# Altium schematic sheet Schematic.schdoc
size A
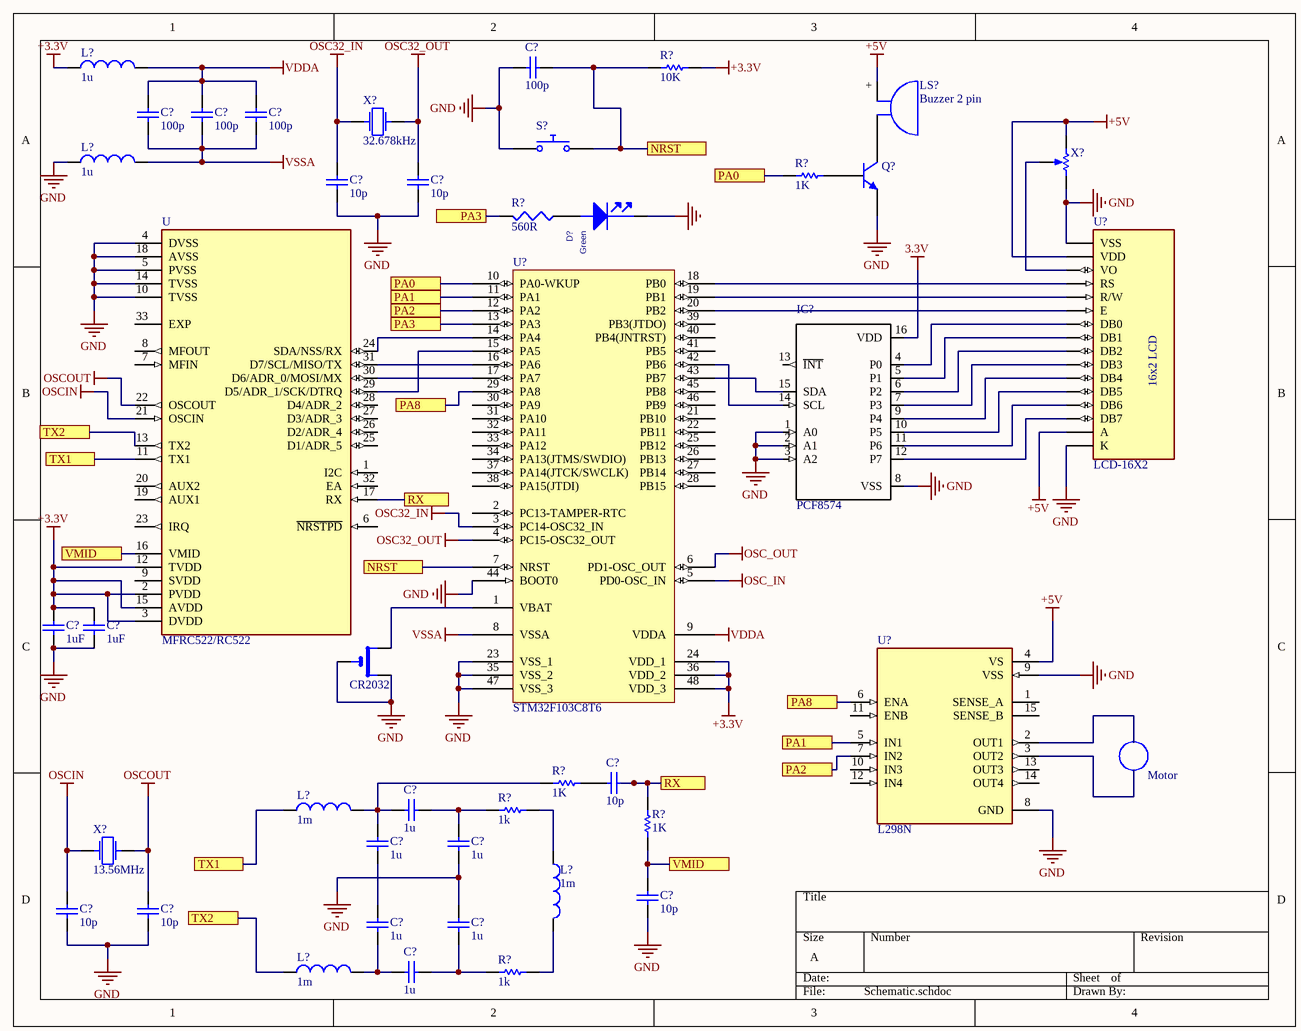
[diagram p0: Schematic.schdoc]

## Parts
(Parts that share a designator on the sheet are numbered #1, #2 ... from top to bottom, then left to right.)
?  CR2032  [CR2032-SMD]
C?#1  value 100p  (hidden comment: Capacitor)
C?#2  value 100p  (hidden comment: Capacitor)
C?#3  value 100p  (hidden comment: Capacitor)
C?#4  value 100p  (hidden comment: Capacitor)
C?#5  value 10p  (hidden comment: Capacitor)
C?#6  value 10p  (hidden comment: Capacitor)
C?#7  value 1uF  (hidden comment: Capacitor)
C?#8  value 1uF  (hidden comment: Capacitor)
C?#9  value 10p  (hidden comment: Capacitor)
C?#10  value 1u  (hidden comment: Capacitor)
C?#11  value 1u  (hidden comment: Capacitor)
C?#12  value 1u  (hidden comment: Capacitor)
C?#13  value 10p  (hidden comment: Capacitor)
C?#14  value 10p  (hidden comment: Capacitor)
C?#15  value 10p  (hidden comment: Capacitor)
C?#16  value 1u  (hidden comment: Capacitor)
C?#17  value 1u  (hidden comment: Capacitor)
C?#18  value 1u  (hidden comment: Capacitor)
D?  Green  [LED_0603]
IC?  PCF8574  [*DIL16]
L?#1  value 1u  (hidden comment: Inductor)
L?#2  value 1u  (hidden comment: Inductor)
L?#3  value 1m  (hidden comment: Inductor)
L?#4  value 1m  (hidden comment: Inductor)
L?#5  value 1m  (hidden comment: Inductor)
LS?  Buzzer 2 pin
Q?  Bipolar NPN 3 Pins Transistor VBIC Model  (value not drawn)
R?#1  value 10K  (hidden comment: Resistor)
R?#2  value 1K  (hidden comment: Resistor)
R?#3  560R  [R0805]
R?#4  value 1K  (hidden comment: Resistor)
R?#5  value 1k  (hidden comment: Resistor)
R?#6  value 1K  (hidden comment: Resistor)
R?#7  value 1k  (hidden comment: Resistor)
S?  Push Button Normally Opened  (value not drawn)
U  MFRC522/RC522  [QFN50P500X500X100-33N]
U?#1  LCD-16X2  [MODULE_LCD-16X2]
U?#2  STM32F103C8T6  [SQFP50P900X900-48L]
U?#3  L298N  [TO127P2020X500X2100-15]
X?#1  F0: 32.678kHz  (hidden comment: Crystal)
X?#2  Potentiometer  (value not drawn)
X?#3  F0: 13.56MHz  (hidden comment: Crystal)

## Ports
NRST, PA0, PA1, PA2, PA3, PA8, RX, TX1, TX2, VMID

## Nets
3.3V: IC?.16(VDD)
+3.3V: C?#7.1 C?#8.1 L?#1.1 R?#1.2 U.2(PVDD) U.3(DVDD) U.12(TVDD) U.15(AVDD) U?#2.24(VDD_1) U?#2.36(VDD_2) U?#2.48(VDD_3)
+5V: LS?.+ U?#1.2(VDD) U?#1.15(A) U?#3.4(VS) X?#2.1(TOP)
GND: ?.+$2(+1) ?.NEG C?#1.2 C?#5.2 C?#6.2 C?#7.2 C?#8.2 C?#12.1 C?#13.2 C?#14.2 C?#15.1 C?#17.2 D?.1(cathode) IC?.1(A0) IC?.2(A1) IC?.3(A2) IC?.8(VSS) L?#2.1 Q?.3(E) S?.1 U.4(DVSS) U.5(PVSS) U.10(TVSS) U.14(TVSS) U.18(AVSS) U?#1.1(VSS) U?#1.16(K) U?#2.23(VSS_1) U?#2.35(VSS_2) U?#2.44(BOOT0) U?#2.47(VSS_3) U?#3.8(GND) U?#3.9(VSS) X?#2.2(BOT)
OSC32_IN: C?#5.1 U?#2.3(PC14-OSC32_IN) X?#1.2
OSC32_OUT: C?#6.1 U?#2.4(PC15-OSC32_OUT) X?#1.1
OSC_IN: U?#2.5(PD0-OSC_IN)
OSC_OUT: U?#2.6(PD1-OSC_OUT)
OSCIN: C?#13.1 U.21(OSCIN) X?#3.2
OSCOUT: C?#14.1 U.22(OSCOUT) X?#3.1
VDDA: C?#2.1 C?#3.1 C?#4.2 L?#1.2 U?#2.9(VDDA)
VSSA: C?#2.2 C?#3.2 C?#4.1 L?#2.2 U?#2.8(VSSA)
NRST: C?#1.1 R?#1.1 S?.2 U?#2.7(NRST) ; port NRST
PA0: R?#2.1 U?#2.10(PA0-WKUP) ; port PA0
PA1: U?#2.11(PA1) U?#3.5(IN1) ; port PA1
PA2: U?#2.12(PA2) U?#3.7(IN2) ; port PA2
PA3: R?#3.2 U?#2.13(PA3) ; port PA3
PA8: U?#2.29(PA8) U?#3.6(ENA) ; port PA8
RX: C?#9.2 R?#6.2 U.17(RX) ; port RX
TX1: L?#3.1 U.11(TX1) ; port TX1
TX2: L?#5.1 U.13(TX2) ; port TX2
VMID: C?#15.2 R?#6.1 U.16(VMID) ; port VMID
Net?_+$1: ?.+$1(POS) U?#2.1(VBAT)
NetC?#9_1: C?#9.1 R?#4.2
NetC?#10_1: C?#10.1 C?#11.2 L?#3.2 R?#4.1
NetC?#10_2: C?#10.2 C?#12.2 R?#5.1
NetC?#11_1: C?#11.1 C?#16.2
NetC?#16_1: C?#16.1 C?#18.1 L?#5.2
NetC?#17_1: C?#17.1 C?#18.2 R?#7.1
NetD?_2: D?.2(ANODE) R?#3.1
NetIC?_4: IC?.4(P0) U?#1.7(DB0)
NetIC?_5: IC?.5(P1) U?#1.8(DB1)
NetIC?_6: IC?.6(P2) U?#1.9(DB2)
NetIC?_7: IC?.7(P3) U?#1.10(DB3)
NetIC?_9: IC?.9(P4) U?#1.11(DB4)
NetIC?_10: IC?.10(P5) U?#1.12(DB5)
NetIC?_11: IC?.11(P6) U?#1.13(DB6)
NetIC?_12: IC?.12(P7) U?#1.14(DB7)
NetIC?_14: IC?.14(SCL) U?#2.42(PB6)
NetIC?_15: IC?.15(SDA) U?#2.43(PB7)
NetL?#4_1: L?#4.1 R?#5.2
NetL?#4_2: L?#4.2 R?#7.2
NetLS?_-: LS?.- Q?.1(C)
NetQ?_2: Q?.2(B) R?#2.2
NetU?#1_3: U?#1.3(VO) X?#2.3(TAP)
NetU?#1_4: U?#1.4(RS) U?#2.18(PB0)
NetU?#1_5: U?#1.5(R/W) U?#2.19(PB1)
NetU?#1_6: U?#1.6(E) U?#2.20(PB2)
NetU_24: U.24(SDA/NSS/RX) U?#2.14(PA4)
NetU_29: U.29(D5/ADR_1/SCK/DTRQ) U?#2.15(PA5)
NetU_30: U.30(D6/ADR_0/MOSI/MX) U?#2.17(PA7)
NetU_31: U.31(D7/SCL/MISO/TX) U?#2.16(PA6)

Not connected (* = marked no-connect by the designer): IC? 13(~{INT}); U 1(I2C) 6(~{NRSTPD}) 7(MFIN) 8(MFOUT) 9(SVDD) 19(AUX1) 20(AUX2) 23(IRQ) 25(D1/ADR_5) 26(D2/ADR_4) 27(D3/ADR_3) 28(D4/ADR_2) 32(EA) 33(EXP); U?#2 2(PC13-TAMPER-RTC) 21(PB10) 22(PB11) 25(PB12) 26(PB13) 27(PB14) 28(PB15) 30(PA9) 31(PA10) 32(PA11) 33(PA12) 34(PA13(JTMS/SWDIO)) 37(PA14(JTCK/SWCLK)) 38(PA15(JTDI)) 39(PB3(JTDO)) 40(PB4(JNTRST)) 41(PB5) 45(PB8) 46(PB9); U?#3 1(SENSE_A) 2(OUT1) 3(OUT2) 10(IN3) 11(ENB) 12(IN4) 13(OUT3) 14(OUT4) 15(SENSE_B)

## Notes on the sheet
- Motor
- (in symbol LCD-16X2) 16x2 LCD

## Library data of the parts
? = CR2032: Coin, 20.0mm Lithium Manganese Dioxide 3V Battery Non-Rechargeable _Primary_; MF: FDK America,; Availability: Unavailable; Price: None; Package: FDK; Value: *; SnapEDA_Link: https://www.snapeda.com/parts/CR2032/FDK%20America%2C%20Inc.%2C%20a%20member%20of%20Fujitsu%20Group/view-part/1775317/?ref=snap; MP: CR2032
C?#1-C?#18 = Capacitor: SimulationGenericComponent: True
D? = LG L29K-G2J1-24-Z: LED SMARTLED GREEN 570NM 0603; Manufacturer: OSRAM Opto Semiconductors Inc; .Checked PCB: used; Current - Test: 2mA; Voltage - Forward (Vf) Typ: 1.7V; Luminous Flux @ Current - Test: 12 mlm; Millicandela Rating: 3.92mcd; Wavelength - Peak: 572nm; Lens Type: Diffused; Lens Style/Size: Rectangle with Flat Top, 1.3mm x 0.8mm; Viewing Angle: 160°; Regulator Topology: Positive Fixed; Voltage - Output: 2.5V; Voltage - Input: 2.6 V ~ 6 V; Voltage - Dropout (Typical): 0.16V @ 500mA; Number of Regulators: 1; Current - Output: 500mA; Current - Limit (Min): 600mA; .Checked SCH: used; Category: Optoelectronics; Supplier Part Number: 475-2709-1-ND; Family: LEDs - <75mA, Discre; Manufacturer Part Number: LG L29K-G2J1-24-Z; Price 1k [$]: 0.08744; Value: Green; Color: Green; Package / Case: 0603 (1608 Metric); Supplier: Digikey; Supplier 1: Digi-Key; Supplier Part Number 1: 475-2709-1-ND; RoHS: RoHS Compliant; Stock 1: 30318; Pricing 1: 1=0.16, 10=0.137, 100=0.1093, 250=0.09564, 500=0.08744 (USD); Wavelength - Dominant: 570nm; Size / Dimension: 1.70mm L x 0.80mm W; Height: 0.65mm; Mounting Type: Surface Mount; Packaging: Cut Tape (CT); ComponentLink1URL: http://catalog.osram-os.com/catalogue/catalogue.do;jsessionid=32CB61882C089EDD4B6D0A54E7E1F117?act=downloadFile&favOid=020000020000138e000100b6; ComponentLink1Description: http://catalog.osram-os.com/catalogue/catalogue.do;jsessionid=32CB61882C089EDD4B6D0A54E7E1F117?act=downloadFile&favOid=020000020000138e000100b6; Operating Temperature: -40°C ~ 125°C; Supplier Device Package: 6-TMLF® (1.6x1.6); ComponentLink2URL: http://www.micrel.com/_PDF/mic5353.pdf; ComponentLink2Description: http://www.micrel.com/_PDF/mic5353.pdf
IC? = PCF8574: I/O Expander 8 IÂ²C 100 kHz 20-VQFN (3.5x4.5); MF: Texas Instruments; SnapEDA_Link: https://www.snapeda.com/parts/PCF8574/Texas+Instruments/view-part/?ref=snap; Package: VFQFN-16 Texas Instruments; MP: PCF8574; Check_prices: https://www.snapeda.com/parts/PCF8574/Texas+Instruments/view-part/?ref=eda; Value: *
L?#1-L?#5 = Inductor: SimulationGenericComponent: True
Q? = BJT NPN VBIC: SimulationGenericComponent: True; AFN: 1; AJC: -0.5; ART: 0.1; AVC1: 0; EA: 1.12; FC: 0.9; IBBE: 1e-06; IBCI: 1e-16; IBEI: 1e-18; MC: 0.33; NCN: 2; NKF: 0.5; PC: 0.75; TNOM: 27; VERS: 1.2; XII: 3; AJE: -0.5; AJS: -0.5; AVC2: 0; BFN: 1; CBCO: 0; CBEO: 0; CCSO: 0; CJC: 0; CJCP: 0; CJE: 0; CJEP: 0; CTH: 0; DEAR: 0; EAIC: 1.12; EAIE: 1.12; EAIS: 1.12; EANC: 1.12; EANE: 1.12; EANS: 1.12; EAP: 1.12; EBBE: 0; GAMM: 0; HRCF: 1; IBCIP: 0; IBCN: 0; IBCNP: 0; IBEIP: 0; IBEN: 0; IBENP: 0; IKF: 0; IKP: 0; IKR: 0; IS: 1e-16; ISP: 0; ISRR: 1; ITF: 0; KFN: 0; ME: 0.33; MS: 0.33; NBBE: 1; NCI: 1; NCIP: 1; NCNP: 2; NEI: 1; NEN: 2; NF: 1; NFP: 1; NR: 1; PE: 0.75; PS: 0.75; QBM: 0; QCO: 0; QTF: 0; RBI: 0.1; RBP: 0.1; RBX: 0; RCI: 0.1; RCX: 0; RE: 0; RS: 0; RTH: 0; TAVC: 0; TD: 0; TF: 0; TNBBE: 0; TNF: 0; TR: 0; TVBBE1: 0; TVBBE2: 0; VBBE: 0; VEF: 0; VER: 0; VO: 0; VREF: 0; VRT: 0; VTF: 0; WBE: 1; WSP: 1; XIKF: 0; XIN: 3; XIS: 3; XISR: 0; XRBI: 0; XRBP: 0; XRBX: 0; XRCI: 0; XRCX: 0; XRE: 0; XRS: 0; XTF: 0; XVO: 0
R?#1 R?#2 R?#4-R?#7 = Resistor: TC1: 0; SimulationGenericComponent: True; TC2: 0
R?#3 = RC0805FR-07560RL: RES SMD 560 OHM 1% 1/8W 0805; Manufacturer: Yageo; Resistance (Ohms): 560; Power (Watts): 0.125W, 1/8W; Temperature Coefficient: ±100ppm/°C; .Creator: MM; .Checked PCB: RF; Supplier 1: Digi-Key; Manufacturer Part Number: RC0805FR-07560RL; RoHS: RoHS Compliant; Category: Resistors; Stock 1: 53313; Pricing 1: 1=0.1, 10=0.021, 25=0.0148, 100=0.0084, 250=0.0064, 500=0.0051, 1000=0.00376, 2500=0.00326 (USD); Packaging: Cut Tape (CT); Tolerance: ±1%; Composition: Thick Film; Features: Moisture Resistant; Operating Temperature: -55°C ~ 155°C; Package / Case: 0805 (2012 Metric); Supplier Device Package: 0805; Size / Dimension: 0.079" L x 0.049" W (2.00mm x 1.25mm); Height: 0.024" (0.60mm); Number of Terminations: 2; ComponentLink1URL: http://www.yageo.com/documents/recent/PYu-RC_Group_51_RoHS_L_1.pdf; ComponentLink1Description: http://www.yageo.com/documents/recent/PYu-RC_Group_51_RoHS_L_1.pdf; Supplier Part Number 1: 311-560CRCT-ND; .Checked SCH: RF
S? = Push Button NO: closed: 0; Rclosed: 1m; Ropen: 1Meg; SimulationGenericComponent: True
U = MFRC522/RC522: RFID Reader IC 13.56MHz ISO 14443, MIFARE IÂ²C, SPI, UART 2.5V ~ 3.3V 32-VFQFN Exposed Pad; MF: NXP Semiconductors; SnapEDA_Link: https://www.snapeda.com/parts/MFRC522/RC522/NXP%20Semiconductors/view-part/792376/?ref=snap; MP: MFRC522/RC522; Price: None; Package: None; Value: *; Availability: Unavailable
U?#1 = LCD-16X2: Display Development Tools 16x2 Black on Green Char LCD w Backlight; MF: Gravitech; Package: None; Price: None; Value: *; SnapEDA_Link: https://www.snapeda.com/parts/LCD-16X2/Gravitech/view-part/?ref=snap; MP: LCD-16X2; Availability: Not in stock; Check_prices: https://www.snapeda.com/parts/LCD-16X2/Gravitech/view-part/?ref=eda
U?#2 = STM32F103C8T6: Medium-density performance line ARM-based 32-bit MCU with 64 or 128 KB Flash, USB, CAN, 7 timers, 2 ADCs, 9 com. interfaces
U?#3 = L298N: Dual Full Bridge Motor Driver 15-Pin(15+Tab) MULTIWATT V Tube; MP: L298N; Availability: Unavailable; Package: None; Value: *; Price: None
X?#1 X?#3 = Crystal: R: 500; Q: 50K; SimulationGenericComponent: True
X?#2 = Potentiometer: value: 1k; position: 0.5; SimulationGenericComponent: True